# EAGLE design dw-link-probe-V2 (EAGLE 9.5.1)
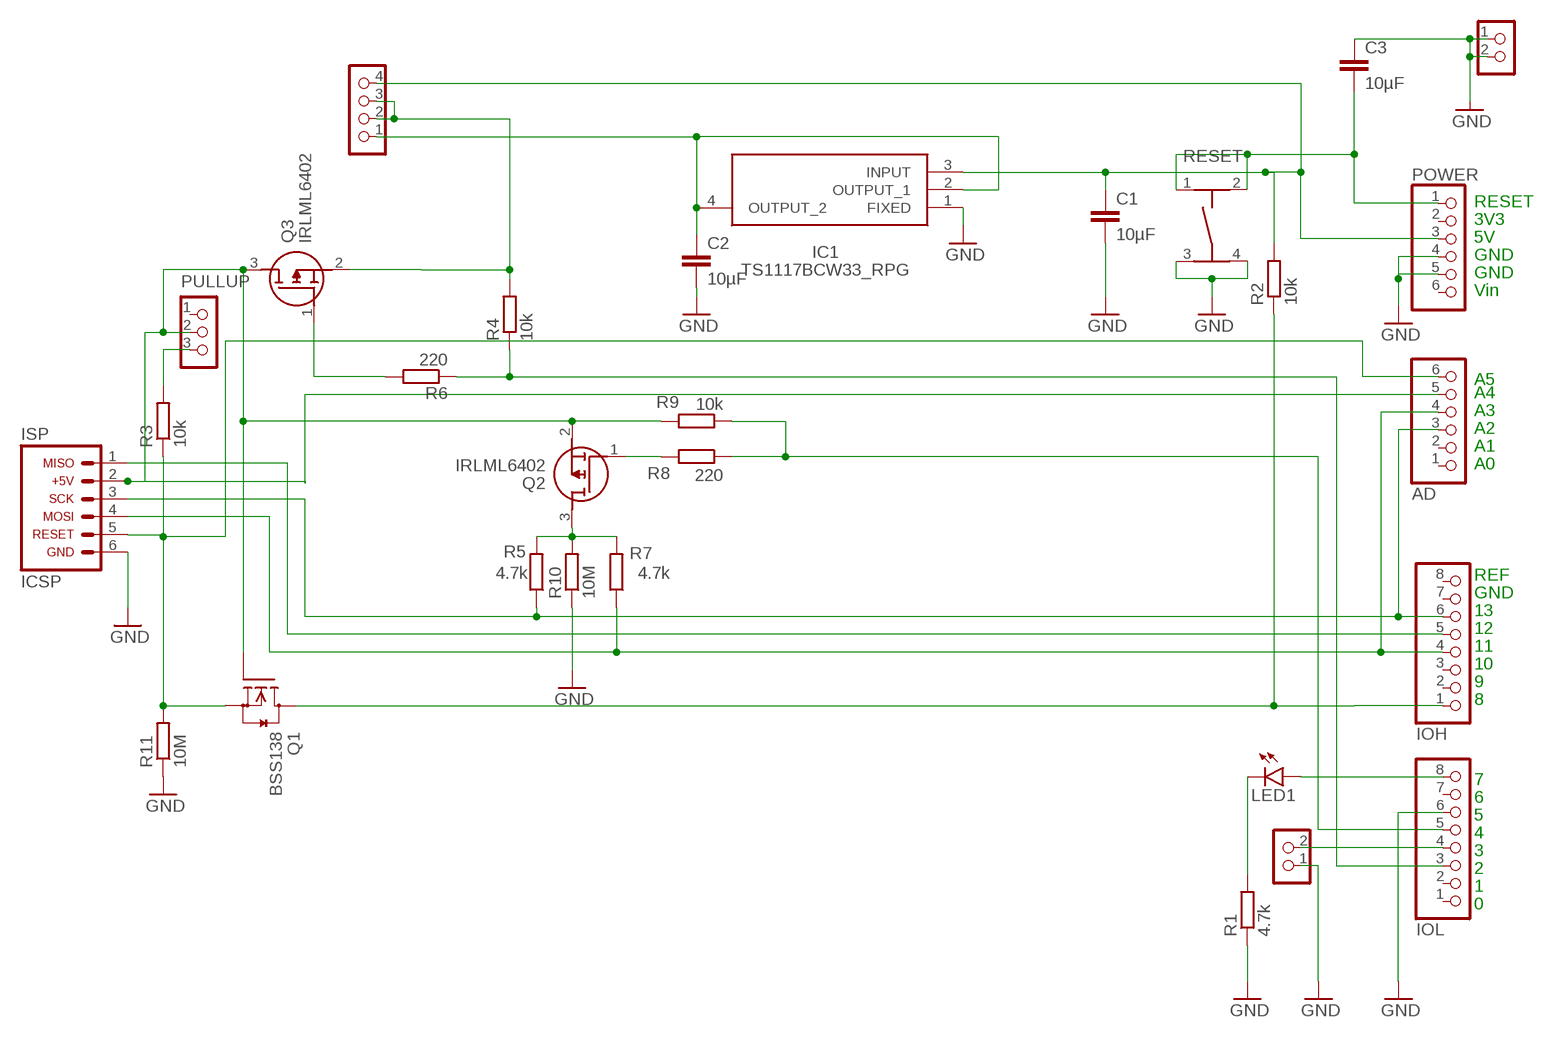
[diagram p0: schematic, sheet 1]

## Parts
AD  PINHD-1X6  [1X06]
C1  10µF  C-EUC1206  [C1206]
C2  10µF  C-EUC1206  [C1206]
C3  10µF  C-EUC1206  [C1206]
DEBUG  CON_HEADER_1X02-PTH  [M1X2]
IC1  TS1117BCW33_RPG  [SOT230P700X190-4N]
IOH  PINHD-1X8  [1X08]
IOL  PINHD-1X8  [1X08]
ISP  ARDUINO_CONN-ICSP  [CONN-2X03]
LED1  LEDCHIPLED_1206  [CHIPLED_1206]
POWER  PINHD-1X6  [1X06]
PULLUP  CON_HEADER_1X03-PTH  [M1X3]
Q1  BSS138  [SOT23]
Q2  IRLML6402  [SOT95P237X112-3N]
Q3  IRLML6402  [SOT95P237X112-3N]
R1  4.7k  R-EU_R1206  [R1206]
R2  10k  R-EU_R1206  [R1206]
R3  10k  R-EU_R1206  [R1206]
R4  10k  R-EU_R1206  [R1206]
R5  4.7k  R-EU_R1206  [R1206]
R6  220  R-EU_R1206  [R1206]
R7  4.7k  R-EU_R1206  [R1206]
R8  220  R-EU_R1206  [R1206]
R9  10k  R-EU_R1206  [R1206]
R10  10M  R-EU_R1206  [R1206]
R11  10M  R-EU_R1206  [R1206]
RESDIS  CON_HEADER_1X02-PTH  [M1X2]
RESET  TASTER-9314_SMD  [TASTER-9314_SMD]
SUPPLY  CON_HEADER_1X04  [M1X4]

## Nets
GND: C1.2 C2.2 C3.1 DEBUG.1 IC1.1(FIXED) IOL.6 ISP.6 POWER.4 POWER.5 R1.1 R10.1 R11.1 RESDIS.1 RESDIS.2 RESET.3 RESET.4
N$1: C1.1 IC1.3(INPUT) POWER.3 R2.2 SUPPLY.4
N$2: IOH.1 Q1.3(D) R2.1
N$3: AD.6 ISP.5 Q1.2(S) R3.1 R11.2
N$4: IOL.3 R4.1 R6.1
N$5: Q3.1(G) R6.2
N$6: AD.5 ISP.2 PULLUP.2 Q1.1(G) Q2.2(S) Q3.3(D) R9.2
N$8: Q2.1(G) R8.2
N$9: IOL.8 LED1.A
N$10: PULLUP.3 R3.2
N$11: IOH.5 ISP.1
N$12: AD.3 IOH.6 ISP.3 R5.1
N$13: AD.4 IOH.4 ISP.4 R7.1
N$14: Q3.2(S) R4.2 SUPPLY.2 SUPPLY.3
N$15: C2.1 IC1.2(OUTPUT_1) IC1.4(OUTPUT_2) SUPPLY.1
N$16: Q2.3(D) R5.2 R7.2 R10.2
N$17: IOL.5 R8.1 R9.1
N$18: DEBUG.2 IOL.4
N$19: C3.2 POWER.1 RESET.1 RESET.2
N$22: LED1.C R1.2
Unconnected: AD.1 AD.2 IOH.2 IOH.3 IOH.7 IOH.8 IOL.1 IOL.2 IOL.7 POWER.2 POWER.6 PULLUP.1

## Notes on the sheet
- RESET
- 3V3
- 5V
- GND
- GND
- Vin
- A5
- A4
- A3
- A2
- A1
- A0
- REF
- GND
- 13
- 12
- 11
- 10
- 9
- 8
- 7
- 6
- 5
- 4
- 3
- 2
- 1
- 0

## Library data of the parts
AD POWER = pinhead:PINHD-1X6: PIN HEADER
C1-C3 = rcl:C-EU: CAPACITOR, European symbol; SPICEPREFIX: C
DEBUG RESDIS = dp_devices:CON_HEADER_1X02
IC1 = TS1117BCW33_RPG:TS1117BCW33_RPG: Taiwan Semiconductor TS1117BCW33 RPG, LDO Regulator, 800mA, 3.3 V, +/-2% 4-Pin, SOT-223 Source: Datasheet <http://uk.rs-online.com/web/p/products/1698939>; ARROW_PART_NUMBER: TS1117BCW33 RPG; ARROW_PRICE-STOCK: https://www.arrow.com/en/products/ts1117bcw33rpg/taiwan-semiconductor; DESCRIPTION: Taiwan Semiconductor TS1117BCW33 RPG, LDO Regulator, 800mA, 3.3 V, +/-2% 4-Pin, SOT-223; HEIGHT: 1.9mm; MANUFACTURER_NAME: Taiwan Semiconductor; MANUFACTURER_PART_NUMBER: TS1117BCW33 RPG; MOUSER_PART_NUMBER: 821-TS1117BCW33RPG; MOUSER_PRICE-STOCK: https://www.mouser.co.uk/ProductDetail/Taiwan-Semiconductor/TS1117BCW33-RPG?qs=5aG0NVq1C4zdwcJSPRwZGg%3D%3D
IOH IOL = pinhead:PINHD-1X8: PIN HEADER
ISP = arduino_jw:ARDUINO_CONN-ICSP: Arduino ICSP I/O Header This is the ICSP I/O header on the Arduino Uno R3. This connector is labeled with the following pin assignments: MISO +5V SCK MOSI RESET GND NOTE: Be sure you install this connector with the correct orientation on your PCB layout. Pin 1 has a square pad to assist with orientation.
LED1 = led:LED: LED OSRAM: - CHIPLED LG R971, LG N971, LY N971, LG Q971, LY Q971, LO R971, LY R971 LH N974, LH R974 LS Q976, LO Q976, LY Q976 LO Q996 - Hyper CHIPLED LW Q18S LB Q993, LB Q99A, LB R99A - SideLED LS A670, LO A670, LY A670, LG A670, LP A670 LB A673, LV A673, LT A673, LW A673 LH A674 LY A675 LS A676, LA A676, LO A676, LY A676, LW A676 LS A679, LY A679, LG A679 - Hyper Micro SIDELED® LS Y876, LA Y876, LO Y876, LY Y876 LT Y87S - SmartLED LW L88C, LW L88S LB L89C, LB L89S, LG L890 LS L89K, LO L89K, LY L89K LS L896, LA L896, LO L896, LY L896 - TOPLED LS T670, LO T670, LY T670, LG T670, LP T670 LSG T670, LSP T670, LSY T670, LOP T670, LYG T670 LG T671, LOG T671, LSG T671 LB T673, LV T673, LT T673, LW T673 LH T674 LS T676, LA T676, LO T676, LY T676, LB T676, LH T676, LSB T676, LW T676 LB T67C, LV T67C, LT T67C, LS T67K, LO T67K, LY T67K, LW E67C LS E67B, LA E67B, LO E67B, LY E67B, LB E67C, LV E67C, LT E67C LW T67C LS T679, LY T679, LG T679 LS T770, LO T770, LY T770, LG T770, LP T770 LB T773, LV T773, LT T773, LW T773 LH T774 LS E675, LA E675, LY E675, LS T675 LS T776, LA T776, LO T776, LY T776, LB T776 LHGB T686 LT T68C, LB T68C - Hyper Mini TOPLED® LB M676 - Mini TOPLED Santana® LG M470 LS M47K, LO M47K, LY M47K Source: http://www.osram.convergy.de LUXEON: - LUMILED® LXK2-PW12-R00, LXK2-PW12-S00, LXK2-PW14-U00, LXK2-PW14-V00 LXK2-PM12-R00, LXK2-PM12-S00, LXK2-PM14-U00 LXK2-PE12-Q00, LXK2-PE12-R00, LXK2-PE12-S00, LXK2-PE14-T00, LXK2-PE14-U00 LXK2-PB12-K00, LXK2-PB12-L00, LXK2-PB12-M00, LXK2-PB14-N00, LXK2-PB14-P00, LXK2-PB14-Q00 LXK2-PR12-L00, LXK2-PR12-M00, LXK2-PR14-Q00, LXK2-PR14-R00 LXK2-PD12-Q00, LXK2-PD12-R00, LXK2-PD12-S00 LXK2-PH12-R00, LXK2-PH12-S00 LXK2-PL12-P00, LXK2-PL12-Q00, LXK2-PL12-R00 Source: www.luxeon.com KINGBRIGHT: KA-3528ASYC Source: www.kingbright.com
PULLUP = dp_devices:CON_HEADER_1X03
Q1 = m-pad-2.1:BSS138: Fairchild Semiconductors BSS138 N-Channel Logic Level Enhancement Mode Field Effect Transistor General Description: These N-Channel enhancement mode field effect transistors are produced using Fairchild's proprietary, high cell density, DMOS technology. These products have been designed to minimize on-state resistance while provide rugged, reliable, and fast switching performance.These products are particularly suited for low voltage, low current applications such as small servo motor control, power MOSFET gate drivers, and other switching applications. Features: 0.22 A, 50 V. RDS(ON) = 3.5Ohm @ VGS = 10 V RDS(ON) = 6.0Ohm @ VGS = 4.5 V High density cell design for extremely low RDS(ON) Rugged and Reliable Compact industry standard SOT-23 surface mount package Please send any comments to: messi@users.sourceforge.net
Q2 Q3 = IRLML6402:IRLML6402: P-Channel MOSFET Transistor, 3.7 A, 20 V, 3-Pin SOT-23 International Rectifier IRLML6402 Source: Datasheet <https://datasheetspdf.com/pdf/513015/InternationalRectifier/IRLML6402/1>; DESCRIPTION: P-Channel MOSFET Transistor, 3.7 A, 20 V, 3-Pin SOT-23 International Rectifier IRLML6402; HEIGHT: 1.12mm; MANUFACTURER_NAME: Infineon; MANUFACTURER_PART_NUMBER: IRLML6402; MOUSER_PART_NUMBER: N/A; MOUSER_PRICE-STOCK: https://www.mouser.co.uk/ProductDetail/Infineon-IR/IRLML6402/?qs=Gkr2N%2F2q3o277qI%252BRzUP%252Bw%3D%3D
R1-R11 = rcl:R-EU_: RESISTOR, European symbol; SPICEPREFIX: R
RESET = Ergaenzung:TASTER-9314_SMD
SUPPLY = dp_devices:CON_HEADER_1X04

## Net classes
0 default: width 0.152 mm, drill 0.305 mm, clearance 0.152 mm

## Board
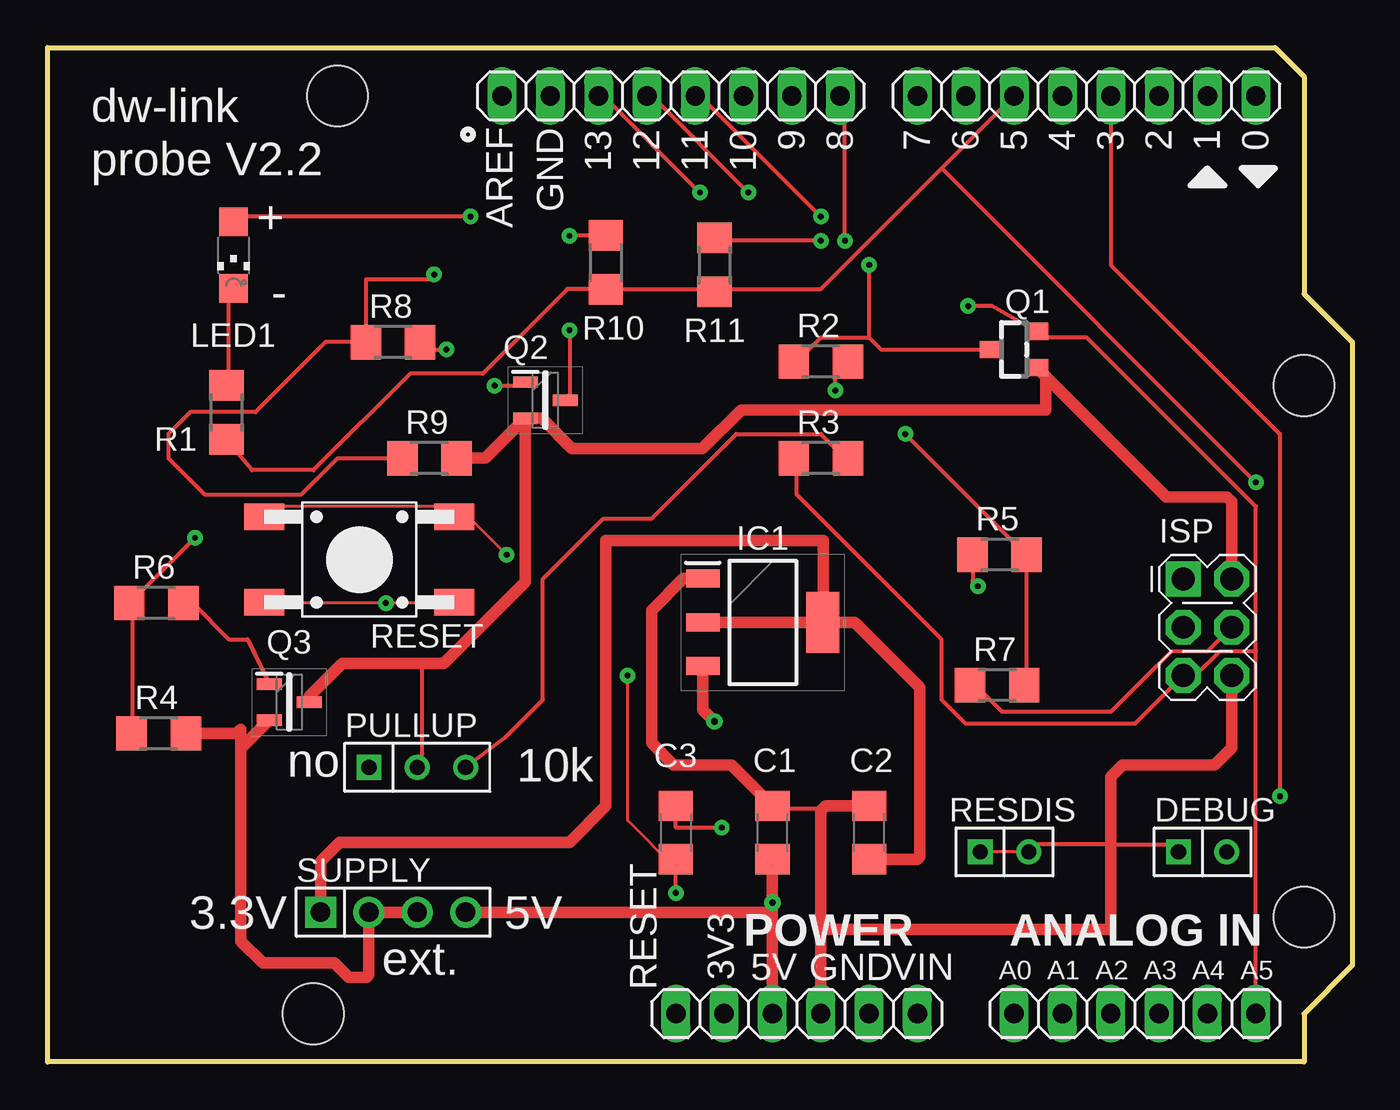
[diagram p1: board, top side]
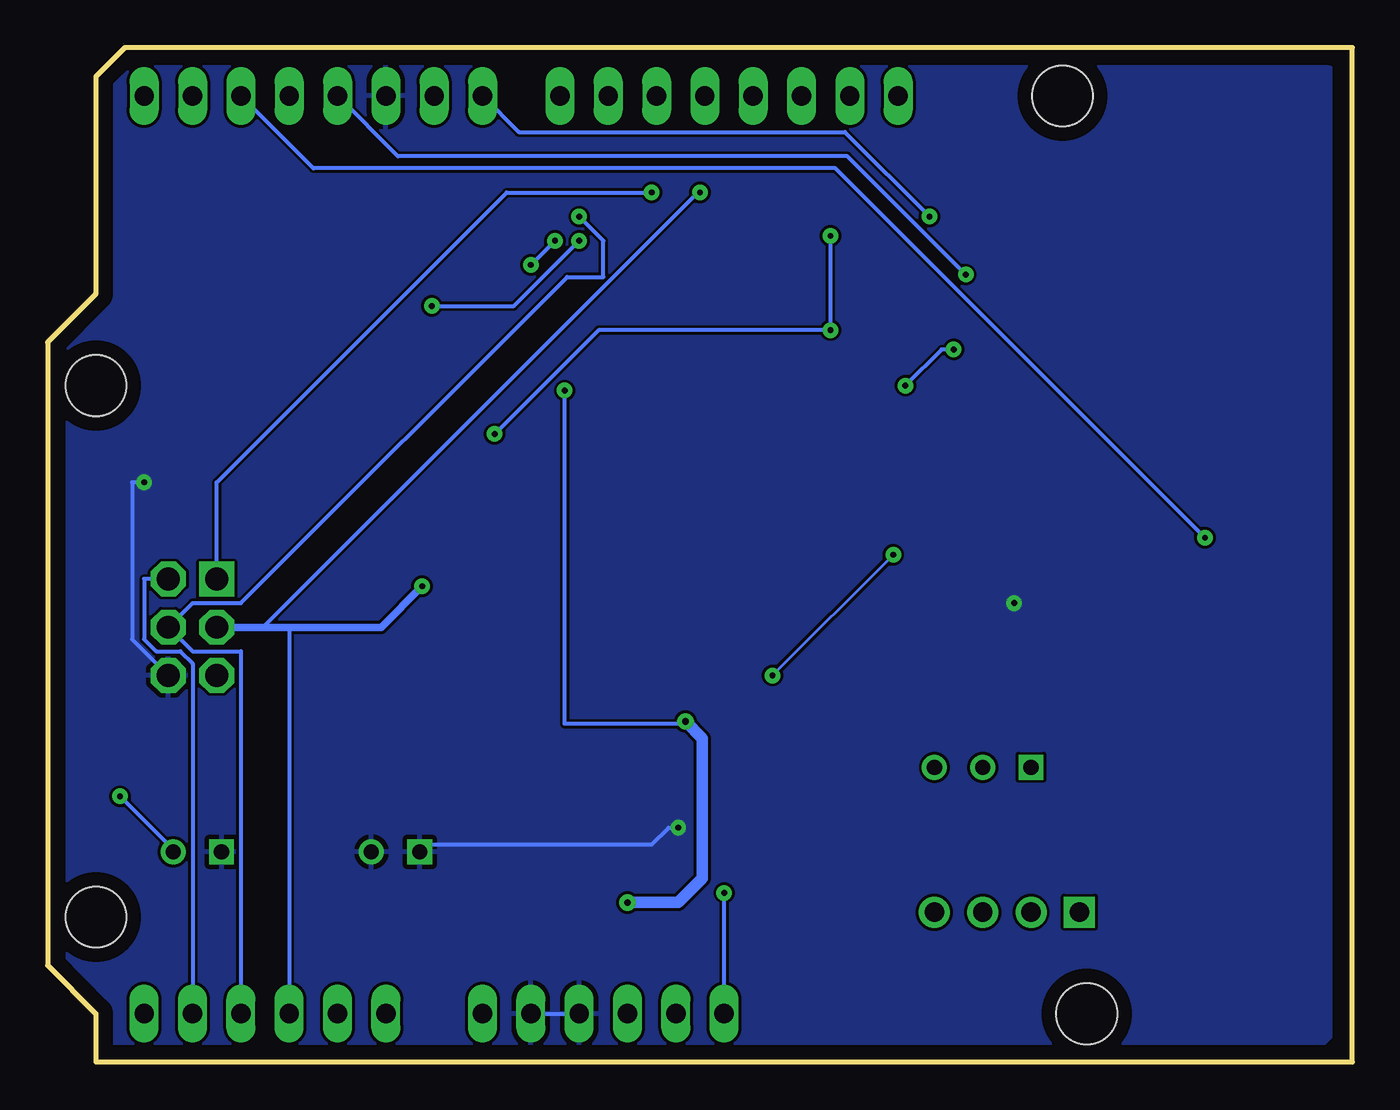
[diagram p2: board, bottom side, seen from below]

Size 68.58 x 53.34 mm. Coordinates in mm from the lower left corner, seen from the top.
Outline: 0,53.34 64.52,53.34 66.04,51.82 66.04,40.39 68.58,37.85 68.58,5.08 66.04,2.54 66.04,0 0,0 0,53.34
Copper layers (1*16): Top 0.035mm / dielectric 1.5mm / Bottom 0.035mm
Design rules "default *": minimum track width 2mil, minimum drill 12mil, track to track 6mil, track to pad 6mil, pad to pad 6mil, via to via 6mil, smd to smd 6mil, copper to edge 30mil, drill to drill 12mil, minimum pad ring 10mil, minimum via ring 10mil, stop-mask expansion 1mil, vias tented up to drill 0mil, thermal gap 10mil
Holes 3.2 mm at 66.04,35.56 66.04,7.62 15.24,50.8 13.97,2.54

### Footprints (pad centres in the part's own frame; a part is rotated, then mirrored left to right if it is on the bottom)
1X06 = drill 1.016 long: 1 -6.35,0; 2 -3.81,0; 3 -1.27,0; 4 1.27,0; 5 3.81,0; 6 6.35,0
C1206 = smd 1.6 x 1.8: 1 -1.4,0; 2 1.4,0
M1X2 = drill 0.8 square: 1 -1.27,0 | drill 0.8: 2 1.27,0
SOT230P700X190-4N = smd 1.75 x 0.95: 1 -3.15,2.3; 2 -3.15,0; 3 -3.15,-2.3 | smd 1.75 x 3.2: 4 3.15,0
1X08 = drill 1.016 long: 1 -8.89,0; 2 -6.35,0; 3 -3.81,0; 4 -1.27,0; 5 1.27,0; 6 3.81,0; 7 6.35,0; 8 8.89,0
CONN-2X03 = drill 1.2 pad 1.829 square: 1 0,0 | drill 1.2 pad 1.829 octagon: 2 2.54,0; 3 0,-2.54; 4 2.54,-2.54; 5 0,-5.08; 6 2.54,-5.08
CHIPLED_1206 = smd 1.5 x 1.5: A 0,-1.75; C 0,1.75
M1X3 = drill 0.8 square: 1 0,0 | drill 0.8: 2 2.54,0; 3 5.08,0
SOT23 = smd 0.9 x 1.2: 1 -0.95,-1.2; 2 0.95,-1.2; 3 0,1.2
SOT95P237X112-3N = smd 1.3 x 0.6: 1 -1.05,0.95; 2 -1.05,-0.95; 3 1.05,0
R1206 = smd 1.6 x 1.803: 1 -1.422,0; 2 1.422,0
TASTER-9314_SMD = smd 2.1 x 1.4: 1 -5,2.25; 2 5,2.25; 3 -5,-2.25; 4 5,-2.25
M1X4 = drill 1.02 pad 1.632 square: 1 0,0 | drill 1.02 pad 1.632: 2 2.54,0; 3 5.08,0; 4 7.62,0

### Placement (x,y rotation side)
AD  57.15,2.54 0 top
C1  38.1,12.06 90 top
C2  43.18,12.06 90 top
C3  33.02,12.06 270 top
DEBUG  60.71,11.05 0 top
IC1  37.59,23.11 0 top
IOH  32.77,50.8 180 top
IOL  54.61,50.8 180 top
ISP  59.69,25.4 0 top
LED1  9.78,42.42 180 top
POWER  39.37,2.54 0 top
PULLUP  16.89,15.49 0 top
Q1  50.8,37.47 90 top
Q2  26.16,34.8 0 top
Q3  12.7,18.92 0 top
R1  9.4,34.16 90 top
R2  40.64,36.83 0 top
R3  40.64,31.75 0 top
R4  5.84,17.27 0 top
R5  50.04,26.67 0 top
R6  5.71,24.13 0 top
R7  49.91,19.81 0 top
R8  18.16,37.85 0 top
R9  20.07,31.75 0 top
R10  29.34,42.04 90 top
R11  35.05,41.91 90 top
RESDIS  50.29,11.05 0 top
RESET  16.38,26.42 0 top
SUPPLY  14.35,7.87 0 top

### Tracks (layer width: path | path; a pad name or v marks a point on that pad's centre or on a via)
GND  (via drill 0.3)
  Top 0.152: RESDIS.2 RESDIS.1 | RESET.3 11.43,24.13 v17.78,24.13 21.59,24.13 RESET.4
  Top 0.203: C2.2 43.18,13.34 C2.2 | RESDIS.2 52.07,11.43 55.88,11.43 59.05,11.43 DEBUG.1 | 38.23,13.34 40.64,13.34 40.64,13.21 | R1.1 10.76,31.11 13.97,31.11 19.05,36.2 22.86,36.2 27.3,40.64 29.21,40.64 R10.1 29.84,40.64 34.92,40.64 R11.1 35.56,40.64 40.64,40.64 46.99,46.99 | 46.99,46.99 IOL.6 | 46.99,46.99 v63.5,30.48 | v35.43,12.32 33.02,12.32 C3.1
  Top 0.406: C1.2 38.23,13.34
  Top 0.61: C2.2 40.89,13.46 40.64,13.21 40.64,6.99 | C1.2 35.94,15.62 32.89,15.62 31.75,16.76 31.75,23.75 33.41,25.41 IC1.1 | POWER.4 40.64,6.99 | ISP.6 62.23,16.51 61.34,15.62 56.52,15.62 55.88,14.99 55.88,11.43 55.88,7.11 55.75,6.99 40.64,6.99
  Bottom 0.203: POWER.5 POWER.4 | ISP.6 64.14,22.23 64.14,30.48 v63.5,30.48 | v35.43,12.32 35.94,12.32 36.83,11.43 48.9,11.43 RESDIS.1
  pour Bottom: 1.14,52.32 1.14,1.27 1.27,1.14 1.91,0.51 65.28,0.51 65.41,0.64 65.41,2.79 67.94,5.33 67.94,6.1 67.94,37.47 65.15,40.26 65.15,40.64 65.15,51.18 65.53,51.56 64.52,52.58 64.39,52.58 1.52,52.58 1.27,52.32
N$1  (via drill 0.3, 0.35)
  Top 0.203: v41.4,35.31 41.4,36.2 42.04,36.83 R2.2
  Top 0.61: C1.1 v38.1,8.38 38.1,7.75 | 38.1,7.75 POWER.3 | v35.05,17.91 34.44,18.52 IC1.3 | SUPPLY.4 37.97,7.87 38.1,7.75
  Bottom 0.203: v41.4,35.31 41.4,17.78 34.92,17.78 v35.05,17.91
  Bottom 0.61: v38.1,8.38 35.43,8.38 34.16,9.65 34.16,17.02 v35.05,17.91 35.05,18.03
N$2  (via drill 0.3)
  Top 0.203: Q1.3 43.81,37.47 43.18,38.1 | 43.18,38.1 40.64,38.1 39.37,36.83 R2.1 | v41.91,43.18 41.91,50.8 IOH.1 | 43.18,38.1 v43.18,41.91
  Bottom 0.203: v43.18,41.91 v41.91,43.18
N$3  (via drill 0.3)
  Top 0.203: R3.1 39.37,31.75 39.37,29.84 46.99,22.23 46.99,19.05 48.26,17.78 57.15,17.78 ISP.5 60.33,20.32 61.59,21.59 63.5,21.59 | AD.6 63.5,21.59 | 63.5,21.59 63.5,29.21 54.61,38.1 52.07,38.1 Q1.2 49.64,39.75 v48.39,39.75 | v40.64,43.18 35.56,43.18 R11.2
  Bottom 0.203: v40.64,43.18 44.07,39.75 v48.39,39.75
N$4  (via drill 0.3)
  Top 0.203: R4.1 4.45,17.78 4.45,24.13 4.32,24.13 | v7.75,27.56 4.32,24.13 | 4.32,24.13 R6.1
  Bottom 0.203: IOL.3 54.61,46.99 27.18,46.99 v7.75,27.56
N$5
  Top 0.203: Q3.1 10.52,22.23 9.53,22.23 7.62,24.13 R6.2
N$6
  Top 0.203: 19.68,20.95 19.68,16.26 PULLUP.2
  Top 0.61: Q2.2 25.11,25.24 20.83,20.95 19.68,20.95 15.49,20.95 13.75,19.21 Q3.3 | Q2.2 23.01,31.75 R9.2 | Q2.2 25.97,33.85 27.56,32.26 34.42,32.26 36.45,34.29 52.45,34.29 52.45,36.06 Q1.1 58.8,29.72 61.98,29.72 62.23,29.46 ISP.2
  Bottom 0.203: AD.5 60.96,20.95 61.59,21.59 62.87,21.59 63.5,22.23 63.5,25.4 ISP.2
N$8  (via drill 0.3)
  Top 0.203: v23.5,35.56 24.77,35.56 Q2.1 | v20.95,37.47 19.68,37.47 R8.2
  Bottom 0.203: v23.5,35.56 21.59,37.47 v20.95,37.47
N$9  (via drill 0.3)
  Top 0.203: v22.23,44.45 10.16,44.45 LED1.A
  Bottom 0.203: v22.23,44.45 26.67,48.9 43.81,48.9 IOL.8
N$10
  Top 0.203: R3.2 41.91,31.75 40.64,33.02 36.2,33.02 31.75,28.57 29.21,28.57 26.04,25.4 26.04,19.05 24,17.02 PULLUP.3
N$11  (via drill 0.3)
  Top 0.203: v36.83,45.72 31.75,50.8 IOH.5
  Bottom 0.203: v36.83,45.72 44.45,45.72 59.69,30.48 ISP.1
N$12  (via drill 0.3)
  Top 0.203: v48.9,25.02 48.62,25.3 R5.1 | v34.29,45.72 29.21,50.8 IOH.6
  Bottom 0.203: ISP.3 57.28,22.86 34.42,45.72 v34.29,45.72 | 57.15,22.86 55.88,22.86 | 55.88,22.86 51.05,22.86 | 55.88,22.86 AD.3
  Bottom 0.406: ISP.3 51.05,22.86 v48.9,25.02
N$13  (via drill 0.3)
  Top 0.203: ISP.4 60.96,21.59 59.05,21.59 55.88,18.41 50.16,18.41 48.9,19.68 R7.1 | v40.64,44.45 34.29,50.8 IOH.4
  Bottom 0.203: AD.4 58.42,21.59 60.96,21.59 ISP.4 60.96,24.13 58.42,24.13 41.27,41.27 39.37,41.27 39.37,43.18 v40.64,44.45
N$14
  Top 0.61: SUPPLY.3 SUPPLY.2 16.89,4.57 16.76,4.45 15.84,4.45 15.07,5.21 11.3,5.21 10.16,6.35 10.16,16.48 | 10.16,16.48 10.16,17.5 9.93,17.27 R4.2 | Q3.2 10.16,16.48
N$15
  Top 0.61: IC1.4 IC1.2 | IC1.4 42.42,23.11 45.85,19.68 45.85,10.79 45.72,10.66 C2.1 | SUPPLY.1 14.35,10.54 15.37,11.56 27.43,11.56 29.34,13.46 29.34,27.43 40.77,27.43 40.77,23.14 IC1.4
N$16  (via drill 0.3)
  Top 0.203: 51.44,26.67 51.44,20.32 R7.2 | v27.43,38.48 27.43,35.1 Q2.3 | R10.2 27.46,43.46 v27.43,43.43 | v45.09,33.02 51.44,26.67 | 51.44,26.67 R5.2
  Bottom 0.203: v27.43,43.43 v27.43,38.48 39.62,38.48 v45.09,33.02
N$17  (via drill 0.3)
  Top 0.203: R9.1 15.24,31.75 13.34,29.84 8.26,29.84 6.35,31.75 6.35,33.02 7.49,34.16 10.92,34.16 14.61,37.85 R8.1 16.74,41.15 20.07,41.15 v20.32,41.4
  Bottom 0.203: IOL.5 50.16,47.62 26.54,47.62 v20.32,41.4
N$18  (via drill 0.3)
  Top 0.203: v64.77,13.97 64.77,33.02 55.88,41.91 IOL.4
  Bottom 0.203: v64.77,13.97 62.23,11.43 DEBUG.2
N$19  (via drill 0.3)
  Top 0.152: 21.59,29.21 11.43,29.21 RESET.1 | v24.13,26.67 21.59,29.21 | v30.48,20.32 30.48,12.7 33.02,10.16 | 21.59,29.21 RESET.2
  Top 0.203: v33.02,8.89 33.02,10.16 C3.2
  Bottom 0.152: v30.48,20.32 v24.13,26.67
  Bottom 0.203: POWER.1 v33.02,8.89
N$22
  Top 0.203: LED1.C 9.53,40.64 9.53,36.07 R1.2

### Text on the board
tPlace: 13 | 12 | 11 | 10 | 9 | 8 | 7 | 6 | 5 | 4 | 3 | 2 | 1 | 0
tNames: dw-link | AREF | GND | probe V2.2 | + | - | no | 10k | 3.3V | 5V | ext. | ANALOG IN | RESET | 3V3 | 5V | GND | VIN | A0 | A1 | A2 | A3 | A4 | A5
214bmp: D:/SmartProjects/Snc/a4_bn_logo2.bmp